# Altium schematic sheet ReceiveController.SchDoc
size A4; DocumentNumber: 3; SheetNumber: 3; SheetTotal: 10
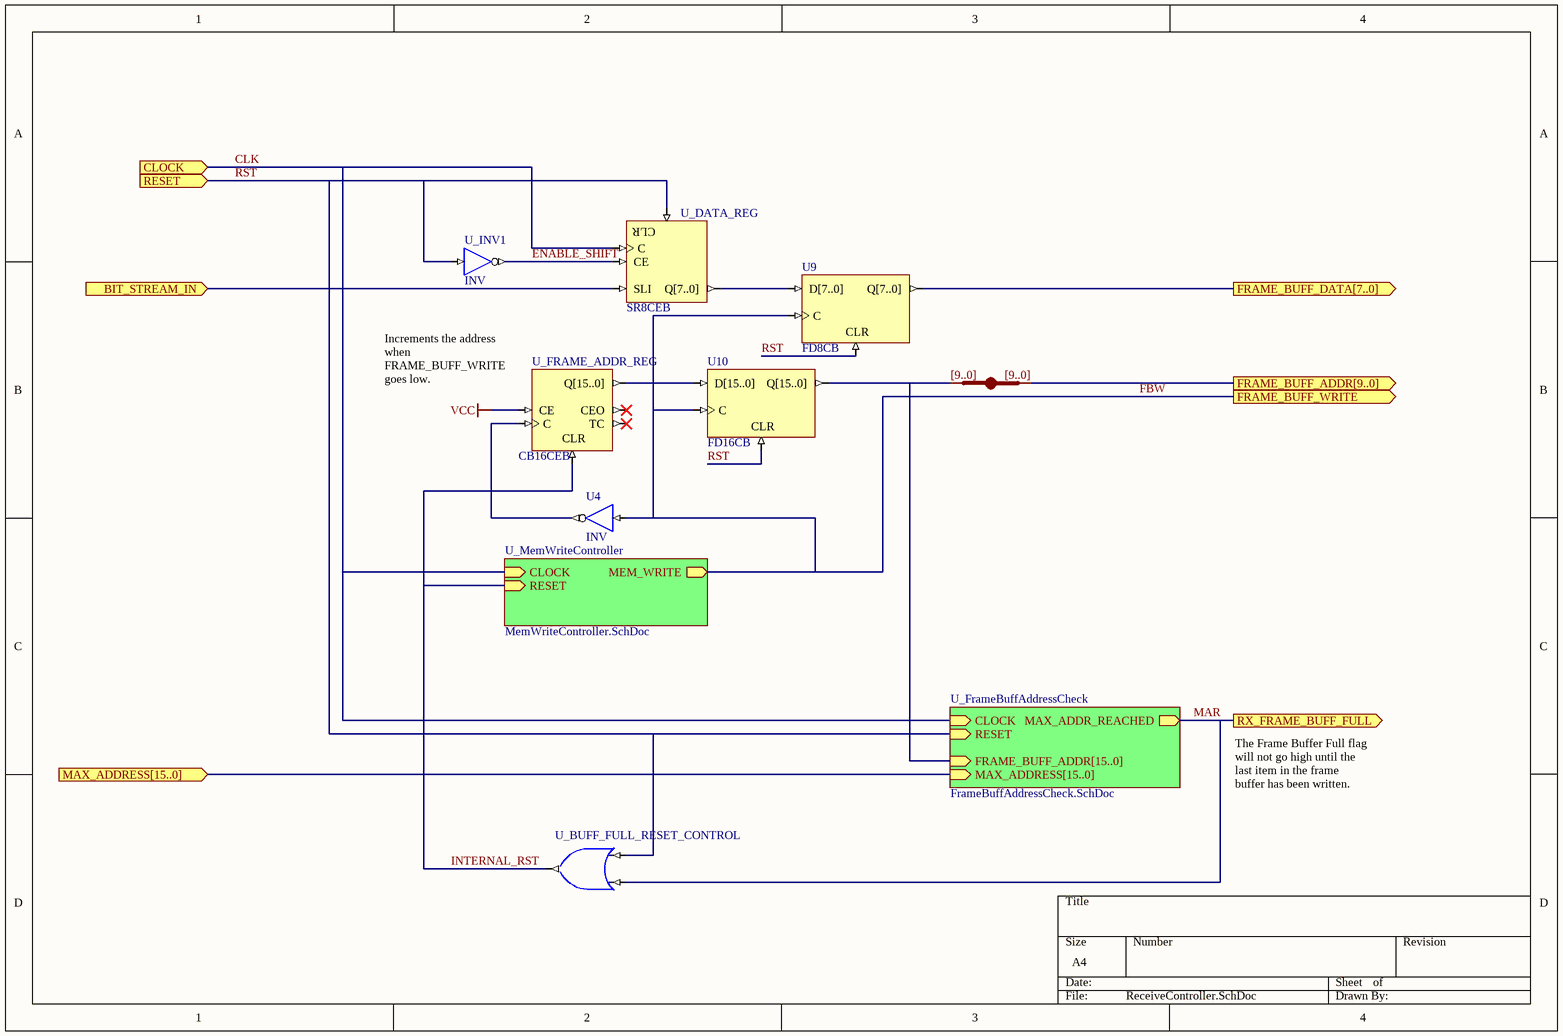
[diagram p0: ReceiveController.SchDoc]

## Parts
JB_AUTO?  IndexA: [9..0]  (hidden comment: JB)
U4  INV
U9  FD8CB
U10  FD16CB
U_BUFF_FULL_RESET_CONTROL  OR2S  (value not drawn)
U_DATA_REG  SR8CEB
U_FRAME_ADDR_REG  CB16CEB
U_INV1  INV

## Sub-sheets
U_FrameBuffAddressCheck = FrameBuffAddressCheck.SchDoc: MAX_ADDR_REACHED (out), CLOCK (in), RESET (in), FRAME_BUFF_ADDR[15..0] (in), MAX_ADDRESS[15..0] (in)
U_MemWriteController = MemWriteController.SchDoc: CLOCK (in), RESET (in), MEM_WRITE (out)

## Ports
BIT_STREAM_IN (in), CLOCK (in), FRAME_BUFF_ADDR[9..0] (out), FRAME_BUFF_DATA[7..0] (out), FRAME_BUFF_WRITE (out), MAX_ADDRESS[15..0] (in), RESET (in), RX_FRAME_BUFF_FULL (out)

## Nets
VCC: U_FRAME_ADDR_REG.CE
BIT_STREAM_IN: U_DATA_REG.SLI ; port BIT_STREAM_IN
CLK: U_DATA_REG.C ; port CLOCK, sheet U_FrameBuffAddressCheck/CLOCK, sheet U_MemWriteController/CLOCK
ENABLE_SHIFT: U_DATA_REG.CE U_INV1.O
FBW: U4.I U9.C U10.C ; port FRAME_BUFF_WRITE, sheet U_MemWriteController/MEM_WRITE
FRAME_BUFF_ADDR[9..0]: JB_AUTO?.B[0..0] ; port FRAME_BUFF_ADDR[9..0]
FRAME_BUFF_DATA[7..0]: U9.Q[7..0] ; port FRAME_BUFF_DATA[7..0]
INTERNAL_RST: U_BUFF_FULL_RESET_CONTROL.O U_FRAME_ADDR_REG.CLR ; sheet U_MemWriteController/RESET
MAR: U_BUFF_FULL_RESET_CONTROL.I0 ; port RX_FRAME_BUFF_FULL, sheet U_FrameBuffAddressCheck/MAX_ADDR_REACHED
RST: U9.CLR U10.CLR U_BUFF_FULL_RESET_CONTROL.I1 U_DATA_REG.CLR U_INV1.I ; port RESET, sheet U_FrameBuffAddressCheck/RESET
NetJB_AUTO?_A[0..0]: JB_AUTO?.A[0..0] U10.Q[15..0] ; sheet U_FrameBuffAddressCheck/FRAME_BUFF_ADDR[15..0]
NetU4_O: U4.O U_FRAME_ADDR_REG.C
NetU9_D[7..0]: U9.D[7..0] U_DATA_REG.Q[7..0]
NetU10_D[15..0]: U10.D[15..0] U_FRAME_ADDR_REG.Q[15..0]

Not connected (* = marked no-connect by the designer): U_FRAME_ADDR_REG CEO* TC*

## Buses and harness runs
bus port MAX_ADDRESS[15..0] = sheet U_FrameBuffAddressCheck/MAX_ADDRESS[15..0]

## Notes on the sheet
- (near U_FRAME_ADDR_REG) Increments the address when FRAME_BUFF_WRITE goes low.
- The Frame Buffer Full flag will not go high until the last item in the frame buffer has been written.

## Library data of the parts
JB_AUTO? = JB: System BUS Joiner; ArchiveName: GENERIC; VHDLIB_SIM: GENERIC_LIB; Published: 29-Jan-2004; Publisher: Altium Limited; Core Revision: 1.00.00; IndexB: [9..0]
U4 U_INV1 = INV: Inverter; ArchiveName: GENERIC; VHDLIB_SIM: GENERIC_LIB; Published: 29-Jan-2004; Publisher: Altium Limited; Xilinx Equivalent: INV; Core Revision: 1.00.00
U9 = FD8CB: 8-Bit D-Type Flip-Flop with Asynchronous Clear, Bus Version; Xilinx Equivalent: FD8C; ArchiveName: GENERIC; VHDLIB_SIM: GENERIC_LIB; Published: 29-Jan-2004; Publisher: Altium Limited; Core Revision: 1.00.00
U10 = FD16CB: 16-Bit D-Type Flip-Flop with Asynchronous Clear, Bus Version; ArchiveName: GENERIC; VHDLIB_SIM: GENERIC_LIB; Published: 29-Jan-2004; Publisher: Altium Limited; Core Revision: 1.00.00
U_BUFF_FULL_RESET_CONTROL = OR2S: 2-Input OR Gate, Single Pin Version; Xilinx Equivalent: OR2; ArchiveName: GENERIC; VHDLIB_SIM: GENERIC_LIB; Published: 29-Jan-2004; Publisher: Altium Limited; Core Revision: 1.00.00
U_DATA_REG = SR8CEB: 8-Bit Serial-In Parallel-Out Shift Registers with Clock Enable and Asynchronous Clear, Bus Version; Xilinx Equivalent: SR8CE; ArchiveName: GENERIC; VHDLIB_SIM: GENERIC_LIB; Published: 29-Jan-2004; Publisher: Altium Limited; Core Revision: 1.00.00
U_FRAME_ADDR_REG = CB16CEB: 16-Bit Cascadable Binary Counters with Clock Enable and Asynchronous Clear, Bus Version; Xilinx Equivalent: CB16CE; ArchiveName: GENERIC; VHDLIB_SIM: GENERIC_LIB; Published: 29-Jan-2004; Publisher: Altium Limited; Core Revision: 1.00.00